# EAGLE schematic p-ok (EAGLE 5.01)
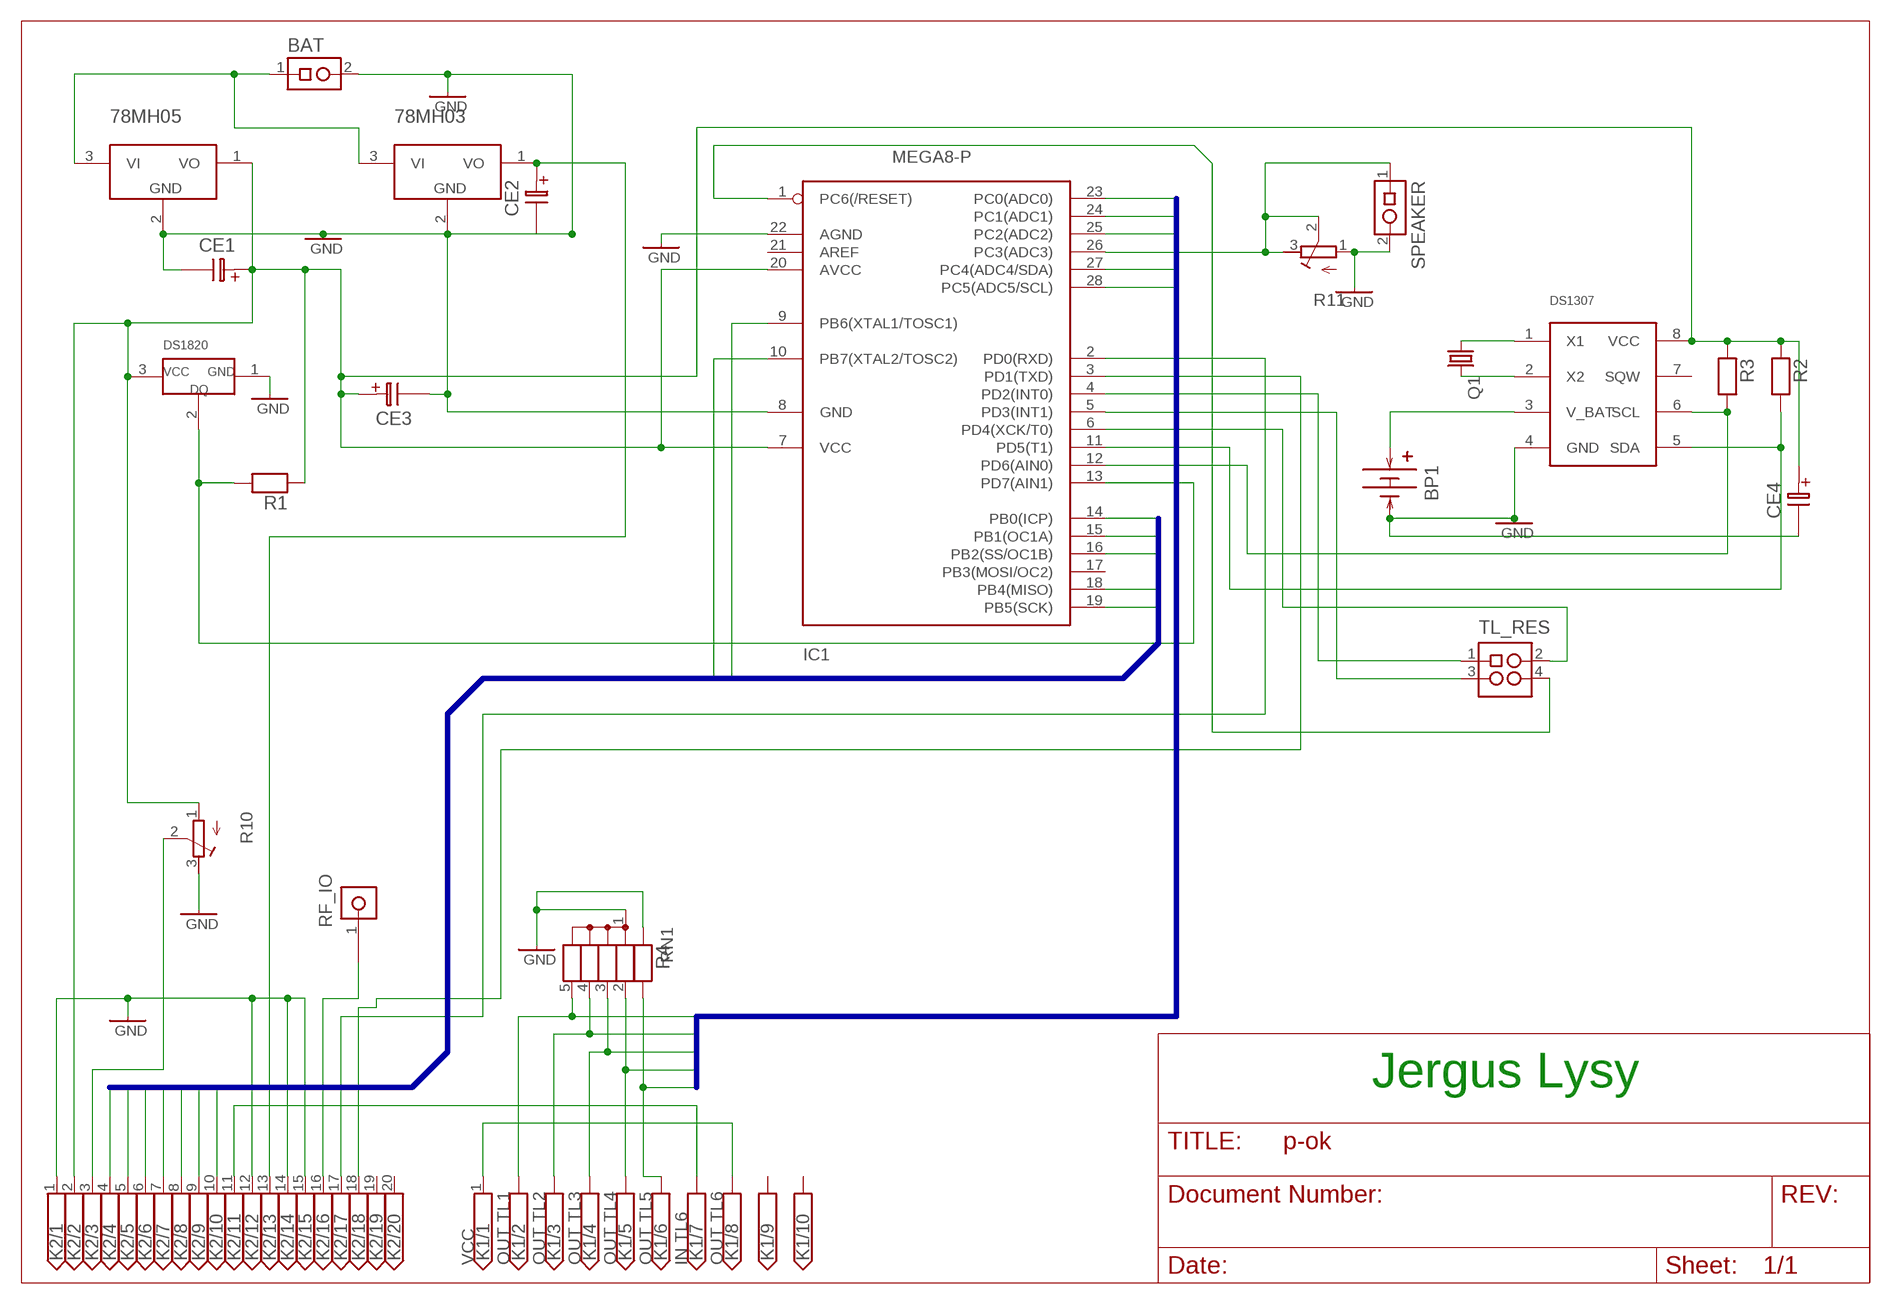
[diagram p0: schematic, sheet 1]

## Parts
78MH03  78LXXZA  [TO-92B]
78MH05  78LXXZA  [TO-92B]
BAT  JUM-1X2  [1X02]
BP1  B_BH2032  [B_BH2032]
CE1  CE-R05_2,5  [CR05_2,5]
CE2  CE-R05_2,5  [CR05_2,5]
CE3  CE-R05_2,5  [CR05_2,5]
CE4  CE-R05_2,5  [CR05_2,5]
DS1307  DS1307  [DIL-08]
DS1820  DS1820  [TO-92B]
IC1  MEGA8-P  [DIL28-3]
K1  PIN-2X5MLW10G  [LH-10]
K2  PIN-2X10LH  [LH-20]
Q1  CRYSTALTC26V  [TC26V]
R1  R_KLASIK2X10S  [R2_10S]
R2  R_KLASIK2X10S  [R2_10S]
R3  R_KLASIK2X10S  [R2_10S]
R4  R_KLASIK2X10S  [R2_10S]
R10  R-TRIMM64P  [RTRIM64P]
R11  R-TRIMM64P  [RTRIM64P]
RF_IO  PINHD-1X1  [1X01]
RN1  RA04  [RN-5]
SPEAKER  JUM-1X2  [1X02]
TL_RES  JUM-2X2  [2X02]

## Nets
+: BP1.B+(+) DS1307.3(V_BAT)
GND: 78MH03.2(GND) 78MH05.2(GND) BAT.2 BP1.B-(-) CE1.2(-) CE2.2(-) CE3.2(-) CE4.2(-) DS1307.4(GND) DS1820.1 IC1.8(GND) IC1.22(AGND) K2.1 K2.12 K2.14 K2.15 R4.1 R10.3(A) R11.1(E) RN1.1 SPEAKER.2
N$1: 78MH03.3(VI) 78MH05.3(VI) BAT.1
N$2: IC1.26(PC3(ADC3)) R11.2(S) R11.3(A) SPEAKER.1
N$4: 78MH03.1(VO) CE2.1(+) K2.13
N$5: DS1820.2 IC1.13(PD7(AIN1)) R1.2
N$6: IC1.4(PD2(INT0)) TL_RES.1
N$7: K2.3 R10.2(S)
N$8: IC1.5(PD3(INT1)) TL_RES.3
N$9: DS1307.1(X1) Q1.1
N$10: DS1307.2(X2) Q1.2
N$11: K1.7 K2.11
N$12: K1.1 K1.8
N$13: DS1307.6(SCL) IC1.12(PD6(AIN0)) R3.2
N$14: DS1307.5(SDA) IC1.11(PD5(T1)) R2.2
N$15: K2.16 RF_IO.1
N$16: IC1.2(PD0(RXD)) K2.17
N$17: IC1.3(PD1(TXD)) K2.18
N$18: IC1.6(PD4(XCK/T0)) TL_RES.2
N$19: IC1.1(PC6(/RESET)) TL_RES.4
PB0: IC1.14(PB0(ICP)) K2.4
PB1: IC1.15(PB1(OC1A)) K2.5
PB2: IC1.16(PB2(SS/OC1B)) K2.6
PB4: IC1.18(PB4(MISO)) K2.7
PB5: IC1.19(PB5(SCK)) K2.8
PB6: IC1.9(PB6(XTAL1/TOSC1)) K2.9
PB7: IC1.10(PB7(XTAL2/TOSC2)) K2.10
PC0: IC1.23(PC0(ADC0)) K1.2 RN1.5
PC1: IC1.24(PC1(ADC1)) K1.3 RN1.4
PC2: IC1.25(PC2(ADC2)) K1.4 RN1.3
PC4: IC1.27(PC4(ADC4/SDA)) K1.5 RN1.2
PC5: IC1.28(PC5(ADC5/SCL)) K1.6 R4.2
VCC: 78MH05.1(VO) CE1.1(+) CE3.1(+) CE4.1(+) DS1307.8(VCC) DS1820.3 IC1.7(VCC) IC1.20(AVCC) K2.2 R1.1 R2.1 R3.1 R10.1(E)
Unconnected: DS1307.7(SQW) IC1.17(PB3(MOSI/OC2)) IC1.21(AREF) K1.9 K1.10 K2.19 K2.20

## Buses
PB0,PB1,PB2,PB3,PB4,PB5,PB6,PB7
PC0,PC1,PC2,PC4,PC5

## Notes on the sheet
- Jergus Lysy
- VCC | OUT TL1 | OUT TL2 | OUT TL3 | OUT TL4 | OUT TL5 | IN TL6 | OUT TL6

## Library data of the parts
78MH03 78MH05 = !LINEAR:78LXXZ
BAT SPEAKER = !PINHEAD:JUM-1X2
BP1 = !ELMECH:B_BH2032
CE1-CE4 = !DISCRET:CE-R
DS1307 = _dallas:DS1307
DS1820 = _dallas:DS1820
IC1 = atmel:MEGA8-P: MICROCONTROLLER 8 Kbytes FLASH, 1 kbytes SRAM, 512 bytes EEPROM, USART, 4-channel 10 bit ADC, 2-channel 8 bit ADC Pin compatible with Atmega48, ATMega88, ATMega168 Source: avr.lbr
K1 = !PINHEAD:PIN-2X5
K2 = !PINHEAD:PIN-2X10
Q1 = crystal:CRYSTAL: CRYSTAL
R1-R4 = !DISCRET:R_KLASIK
R10 R11 = rcl:R-TRIMM: Trimm resistor
RF_IO = !PINHEAD:PINHD-1X1
RN1 = !DISCRET:RA04
TL_RES = !PINHEAD:JUM-2X2